# EAGLE design PIC18F25k50-USB+PicKit3-Board (EAGLE 7.2.0)
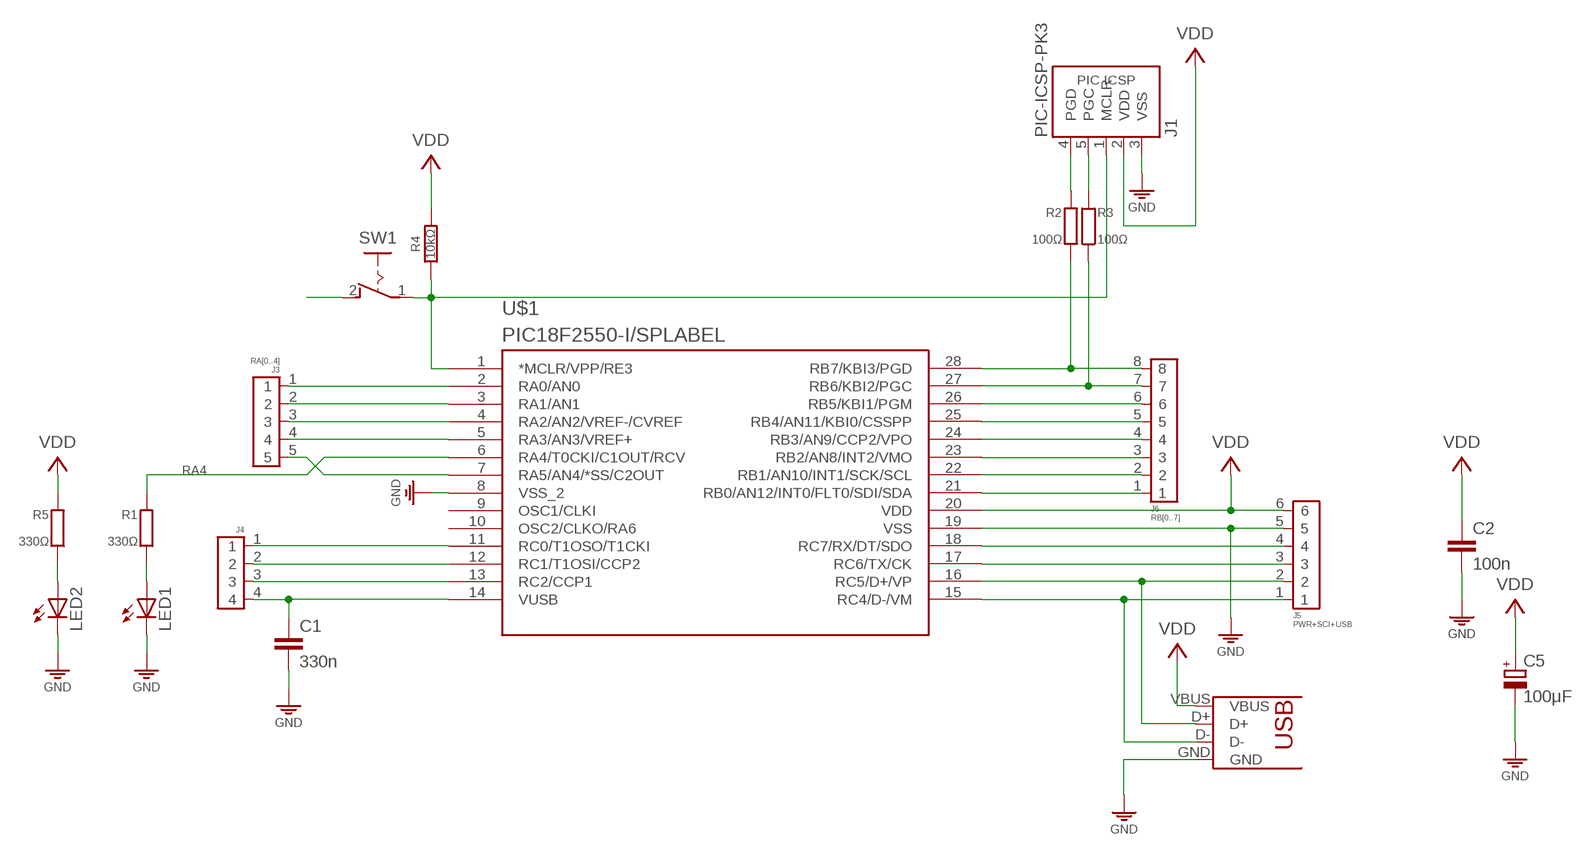
[diagram p0: schematic, sheet 1]

## Parts
C1  330n  C050-030X075  [C050-030X075]
C2  100n  C025-015X024  [C025-015X024]
C5  100μF  CPOLE2.5-5  [E2,5-5]
J1  PIC-ICSP-PK3  [PIC-PK3]
J2  USB-PRINT  [USB-B-PRINT]
J3  RA[0..4]  CONN-5P  [CONN-5P-N]
J4  RC[0..3]  CONN-4P-4P  [CONN-4P]
J5  PWR+SCI+USB  CONN-6P  [CONN-6P]
J6  RB[0..7]  CONN-8P  [CONN-8P]
LED1  LED5MM  [LED5MM]
LED2  LED5MM  [LED5MM]
R1  330Ω  R0204/10  [0204/10]
R2  100Ω  R0204/7-V  [0204/7-V]
R3  100Ω  R0204/7-V  [0204/7-V]
R4  10kΩ  R-H0204/10  [0204/10]
R5  330Ω  R0204/10  [0204/10]
SW1  PB-1P-1T  [PB-1P1T]
U$1  PIC18F2550-I/SPLABEL  [PIC18F2550-V]

## Nets
/MCLR: J1.1(MCLR) R4.1 SW1.1(P) U$1.1(*MCLR/VPP/RE3)
A0: J3.1 U$1.2(RA0/AN0)
A1: J3.2 U$1.3(RA1/AN1)
A2: J3.3 U$1.4(RA2/AN2/VREF-/CVREF)
A3: J3.4 U$1.5(RA3/AN3/VREF+)
B1: J6.2 U$1.22(RB1/AN10/INT1/SCK/SCL)
B2: J6.3 U$1.23(RB2/AN8/INT2/VMO)
B3: J6.4 U$1.24(RB3/AN9/CCP2/VPO)
B4: J6.5 U$1.25(RB4/AN11/KBI0/CSSPP)
B5: J6.6 U$1.26(RB5/KBI1/PGM)
D+: J2.D+ J5.2 U$1.16(RC5/D+/VP)
D-: J2.D- J5.1 U$1.15(RC4/D-/VM)
GND: C1.2 C2.2 C5.- J1.3(VSS) J2.GND J5.5 LED1.K(C) LED2.K(C) SW1.2(S) U$1.8(VSS_2) U$1.19(VSS)
N$1: LED1.A R1.2
N$2: LED2.A R5.2
N$13: J6.1 U$1.21(RB0/AN12/INT0/FLT0/SDI/SDA)
N$24: J1.4(PGD) R2.1
N$25: J1.5(PGC) R3.1
PGC: J6.7 R3.2 U$1.27(RB6/KBI2/PGC)
PGD: J6.8 R2.2 U$1.28(RB7/KBI3/PGD)
RA4: R1.1 U$1.6(RA4/T0CKI/C1OUT/RCV)
RA5: J3.5 U$1.7(RA5/AN4/*SS/C2OUT)
RC0: J4.1 U$1.11(RC0/T1OSO/T1CKI)
RC1: J4.2 U$1.12(RC1/T1OSI/CCP2)
RC2: J4.3 U$1.13(RC2/CCP1)
RX: J5.4 U$1.18(RC7/RX/DT/SDO)
TX: J5.3 U$1.17(RC6/TX/CK)
VCC: C2.1 C5.+ J1.2(VDD) J2.VBUS J5.6 R4.2 R5.1 U$1.20(VDD) ; supply symbol labelled VDD
VUSB: C1.1 J4.4 U$1.14(VUSB)
Unconnected: U$1.9(OSC1/CLKI) U$1.10(OSC2/CLKO/RA6)

## Library data of the parts
C1 C2 = c:C: CAPACITOR, European symbol
C5 = c:CPOL: POLARIZED CAPACITOR, European symbol
J1 = pinconn:PIC-ICSP
J2 = usb:USB: USB Connectors USB-B-PTH is fully proven SKU : PRT-00139 USB-miniB is fully proven SKU : PRT-00587 USB-A-PCB is untested. USB-A-H is throughly reviewed, but untested. Spark Fun Electronics SKU : PRT-00437 USB-B-SMT is throughly reviewed, but untested. Needs silkscreen touching up. USB-A-S has not been used/tested USB-MB-H has not been used/tested
J3 = pinconn:CONN-5P
J4 = pinconn:CONN-4P
J5 = pinconn:CONN-6P
J6 = pinconn:CONN-8P
LED1 LED2 = led:LED: LED OSRAM: - CHIPLED LG R971, LG N971, LY N971, LG Q971, LY Q971, LO R971, LY R971 LH N974, LH R974 LS Q976, LO Q976, LY Q976 LO Q996 - Hyper CHIPLED LW Q18S LB Q993, LB Q99A, LB R99A - SideLED LS A670, LO A670, LY A670, LG A670, LP A670 LB A673, LV A673, LT A673, LW A673 LH A674 LY A675 LS A676, LA A676, LO A676, LY A676, LW A676 LS A679, LY A679, LG A679 - Hyper Micro SIDELED® LS Y876, LA Y876, LO Y876, LY Y876 LT Y87S - SmartLED LW L88C, LW L88S LB L89C, LB L89S, LG L890 LS L89K, LO L89K, LY L89K LS L896, LA L896, LO L896, LY L896 - TOPLED LS T670, LO T670, LY T670, LG T670, LP T670 LSG T670, LSP T670, LSY T670, LOP T670, LYG T670 LG T671, LOG T671, LSG T671 LB T673, LV T673, LT T673, LW T673 LH T674 LS T676, LA T676, LO T676, LY T676, LB T676, LH T676, LSB T676, LW T676 LB T67C, LV T67C, LT T67C, LS T67K, LO T67K, LY T67K, LW E67C LS E67B, LA E67B, LO E67B, LY E67B, LB E67C, LV E67C, LT E67C LW T67C LS T679, LY T679, LG T679 LS T770, LO T770, LY T770, LG T770, LP T770 LB T773, LV T773, LT T773, LW T773 LH T774 LS E675, LA E675, LY E675, LS T675 LS T776, LA T776, LO T776, LY T776, LB T776 LHGB T686 LT T68C, LB T68C - Hyper Mini TOPLED® LB M676 - Mini TOPLED Santana® LG M470 LS M47K, LO M47K, LY M47K Source: http://www.osram.convergy.de LUXEON: - LUMILED® LXK2-PW12-R00, LXK2-PW12-S00, LXK2-PW14-U00, LXK2-PW14-V00 LXK2-PM12-R00, LXK2-PM12-S00, LXK2-PM14-U00 LXK2-PE12-Q00, LXK2-PE12-R00, LXK2-PE12-S00, LXK2-PE14-T00, LXK2-PE14-U00 LXK2-PB12-K00, LXK2-PB12-L00, LXK2-PB12-M00, LXK2-PB14-N00, LXK2-PB14-P00, LXK2-PB14-Q00 LXK2-PR12-L00, LXK2-PR12-M00, LXK2-PR14-Q00, LXK2-PR14-R00 LXK2-PD12-Q00, LXK2-PD12-R00, LXK2-PD12-S00 LXK2-PH12-R00, LXK2-PH12-S00 LXK2-PL12-P00, LXK2-PL12-Q00, LXK2-PL12-R00 Source: www.luxeon.com KINGBRIGHT: KA-3528ASYC Source: www.kingbright.com
R1-R3 R5 = r:R: RESISTOR, European symbol
R4 = r:R-H
SW1 = sw:PB-1P-1T
U$1 = mcu:PIC18F2550-I/SP

## Board
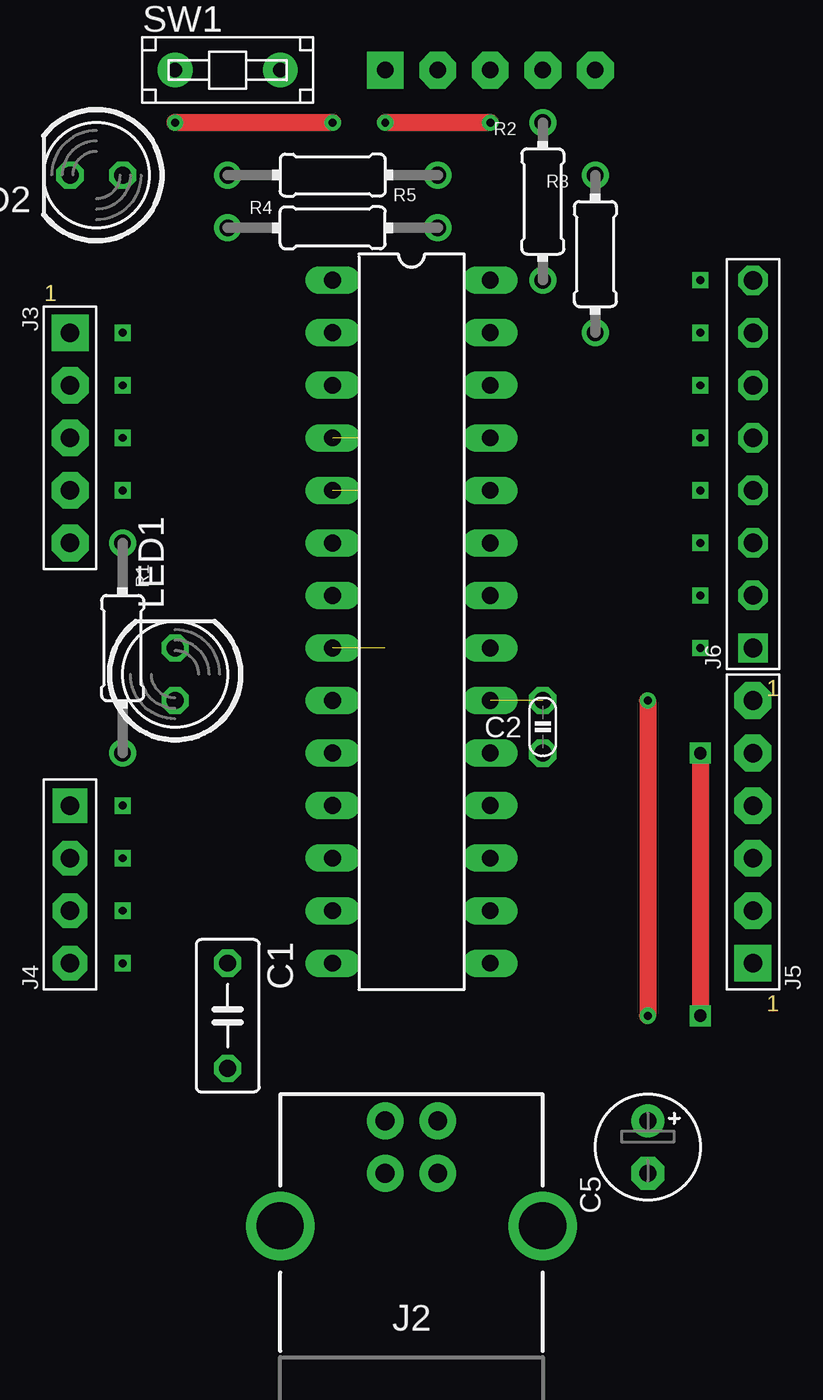
[diagram p1: board, top side]
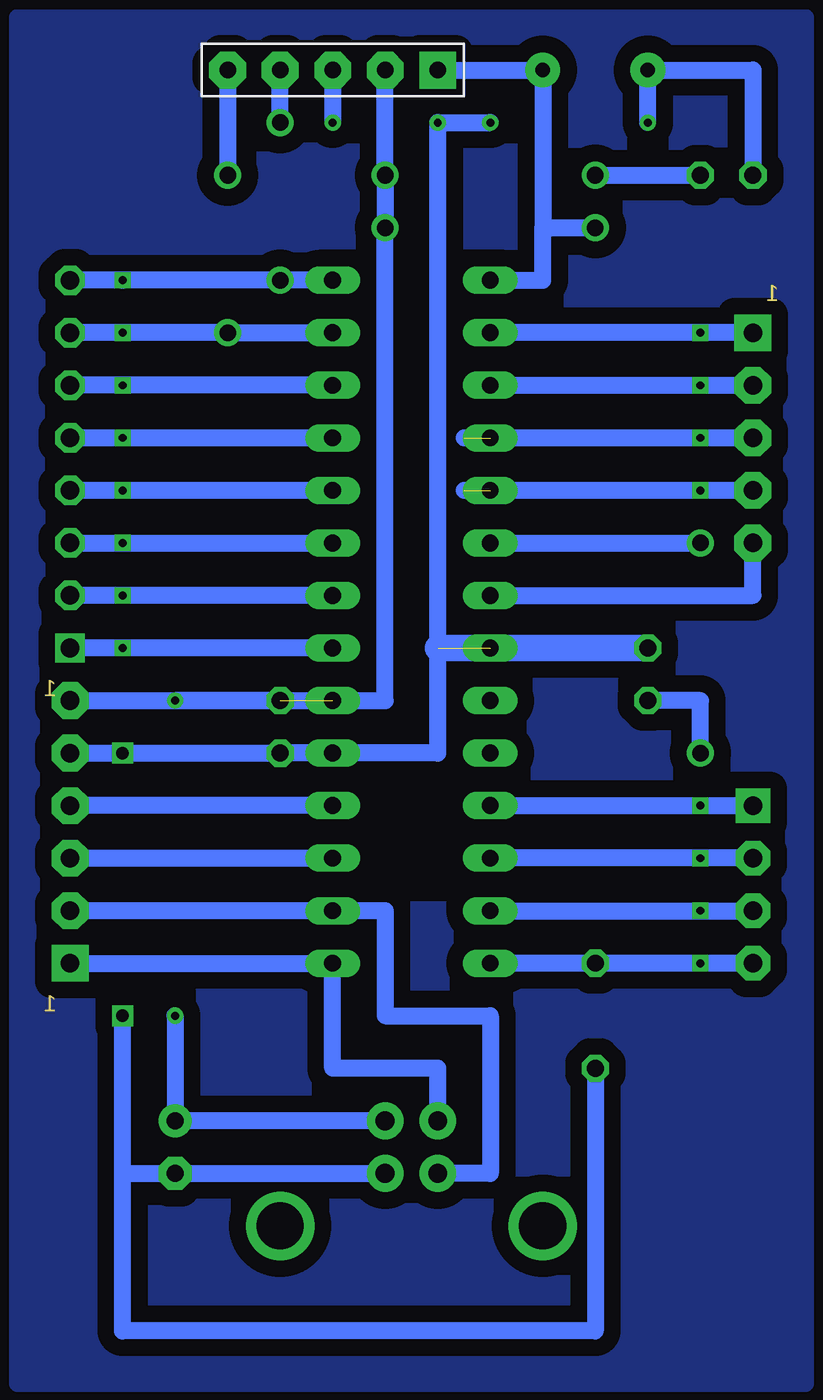
[diagram p2: board, bottom side, seen from below]

No outline drawn. Coordinates in mm, seen from the top.
Copper layers (1*16): Top 0.035mm / dielectric 1.5mm / Bottom 0.035mm
Design rules "default": minimum track width 10mil, minimum drill 24mil, track to track 8mil, track to pad 8mil, pad to pad 8mil, via to via 8mil, smd to smd 8mil, copper to edge 40mil, drill to drill 8mil, minimum pad ring 10mil, minimum via ring 8mil, stop-mask expansion 4mil, vias tented up to drill 0mil, thermal gap 10mil
bRestrict: area 17.8,24.1 to 20.3,29.2

### Footprints (pad centres in the part's own frame; a part is rotated, then mirrored left to right if it is on the bottom)
C050-030X075 = drill 0.813 octagon: 1 -2.54,0; 2 2.54,0
C025-015X024 = drill 0.813 octagon: 1 0,1.27; 2 0,-1.27
E2,5-5 = drill 0.813 pad 1.6: + 1.27,0 | drill 0.813 pad 1.6 octagon: - -1.27,0
PIC-PK3 = drill 0.8 pad 1.778 square: 1 -5.08,0 | drill 0.8 pad 1.778 octagon: 2 -2.54,0; 3 0,0; 4 2.54,0; 5 5.08,0
USB-B-PRINT = drill 0.914 pad 1.778: D+ 2.54,0; D- 5.08,0; GND 2.54,-2.54; VBUS 5.08,-2.54 | drill 2.286: P$1 0,-7.62; P$2 0,5.08
CONN-5P-N = drill 0.9 pad 1.778 square: 1 -5.08,0 | drill 0.9 pad 1.778 octagon: 2 -2.54,0; 3 0,0; 4 2.54,0; 5 5.08,0
CONN-4P = drill 0.9 pad 1.676 square: 1 -3.81,0 | drill 0.9 pad 1.676 octagon: 2 -1.27,0; 3 1.27,0; 4 3.81,0
CONN-6P = drill 0.9 pad 1.778 square: 1 -6.35,0 | drill 0.9 pad 1.778 octagon: 2 -3.81,0; 3 -1.27,0; 4 1.27,0; 5 3.81,0; 6 6.35,0
CONN-8P = drill 0.9 pad 1.422 square: 1 0,0 | drill 0.9 pad 1.422 octagon: 2 2.54,0; 3 5.08,0; 4 7.62,0; 5 10.16,0; 6 12.7,0; 7 15.24,0; 8 17.78,0
LED5MM = drill 0.813 octagon: A -1.27,0; K 1.27,0
0204/10 = drill 0.8: 1 -5.08,0; 2 5.08,0
0204/7-V = drill 0.8: 1 0,3.81; 2 0,-3.81
PB-1P1T = drill 0.7 pad 1.676: 1 2.54,0; 2 -2.54,0
PIC18F2550-V = drill 0.813 long: 1 -3.81,15.24; 2 -3.81,12.7; 3 -3.81,10.16; 4 -3.81,7.62; 5 -3.81,5.08; 6 -3.81,2.54; 7 -3.81,0; 8 -3.81,-2.54; 9 -3.81,-5.08; 10 -3.81,-7.62; 11 -3.81,-10.16; 12 -3.81,-12.7; 13 -3.81,-15.24; 14 -3.81,-17.78; 15 3.81,-17.78; 16 3.81,-15.24; 17 3.81,-12.7; 18 3.81,-10.16; 19 3.81,-7.62; 20 3.81,-5.08; 21 3.81,-2.54; 22 3.81,0; 23 3.81,2.54; 24 3.81,5.08; 25 3.81,7.62; 26 3.81,10.16; 27 3.81,12.7; 28 3.81,15.24

### Placement (x,y rotation side)
C1  10.16,17.78 270 top
C2  25.4,31.75 0 top
C5  30.48,11.43 90 top
J1  22.86,63.5 0 top
J2  17.78,7.62 90 top
J3  2.54,45.72 270 top
J4  2.54,24.13 270 top
J5  35.56,26.67 90 top
J6  35.56,35.56 90 top
LED1  7.62,34.29 90 top
LED2  3.81,58.42 180 top
R1  5.08,35.56 270 top
R2  25.4,57.15 0 top
R3  27.94,54.61 0 top
R4  15.24,55.88 0 top
R5  15.24,58.42 180 top
SW1  10.16,63.5 0 top
U$1  19.05,38.1 0 top

### Tracks (layer width: path | path; a pad name or v marks a point on that pad's centre or on a via)
/MCLR  (via drill 0.38)
  Bottom 0.813: U$1.1 12.7,53.34 12.7,55.88 | J1.1 SW1.1 12.7,55.88 | 12.7,55.88 R4.1
  other vias: 12.7,63.5 12.7,63.5
A0  (via drill 0.38)
  Bottom 0.813: J3.1 v5.08,50.8 U$1.2
A1  (via drill 0.38)
  Bottom 0.813: U$1.3 v5.08,48.26 J3.2
A2  (via drill 0.38)  (1 unrouted)
  Bottom 0.813: J3.3 v5.08,45.72 16.51,45.72
A3  (via drill 0.38)  (1 unrouted)
  Bottom 0.813: J3.4 v5.08,43.18 16.51,43.18
B1  (via drill 0.38)
  Bottom 0.813: U$1.22 v33.02,38.1 J6.2
B2  (via drill 0.38)
  Bottom 0.813: J6.3 v33.02,40.64 U$1.23
B3  (via drill 0.38)
  Bottom 0.813: U$1.24 v33.02,43.18 J6.4
B4  (via drill 0.38)
  Bottom 0.813: U$1.25 v33.02,45.72 J6.5
B5  (via drill 0.38)
  Bottom 0.813: U$1.26 v33.02,48.26 J6.6
D+
  Bottom 0.813: J2.D+ 15.24,10.16 15.24,17.78 20.32,17.78 20.32,22.86 U$1.16 J5.2
D-
  Bottom 0.813: J2.D- 17.78,15.24 22.86,15.24 U$1.15 J5.1
GND  (via drill 0.38, 0.6)  (1 unrouted)
  Top 0.813: v33.02,30.48 v33.02,17.78 | v22.86,60.96 v17.78,60.96 | v15.24,60.96 v7.62,60.96
  Bottom 0.813: J5.5 v33.02,30.48 C2.2 U$1.19 17.78,30.48 17.78,35.56 v17.78,60.96 v15.24,60.96 | 33.02,10.16 v33.02,17.78 | C1.2 10.16,2.54 33.02,2.54 33.02,10.16 | 33.02,10.16 C5.- J2.GND | J1.3 v22.86,60.96 | v7.62,60.96 SW1.2 2.54,63.5 LED2.K
  Bottom 1.27: LED1.K 17.78,35.56
N$1
  Bottom 0.813: R1.2 5.08,33.02 LED1.A
N$2
  Bottom 0.813: R5.2 LED2.A
N$3
  pour Bottom (isolate 0.813): 0,0 38.1,0 38.1,66.04 0,66.04
N$13  (via drill 0.38)
  Bottom 0.813: U$1.21 v33.02,35.56 J6.1
N$24
  Bottom 0.813: R2.1 J1.4
N$25
  Bottom 0.813: J1.5 R3.1
PGC  (via drill 0.38)
  Bottom 0.813: J6.7 v33.02,50.8 R3.2 U$1.27
PGD  (via drill 0.38)
  Bottom 0.813: J6.8 v33.02,53.34 R2.2 U$1.28
RA4  (via drill 0.38)
  Bottom 0.813: U$1.6 R1.1
  other vias: 5.08,40.64
RA5
  Bottom 0.813: U$1.7 2.54,38.1 J3.5
RC0  (via drill 0.38)
  Bottom 0.813: U$1.11 v5.08,27.94 J4.1
RC1  (via drill 0.38)
  Bottom 0.813: J4.2 v5.08,25.4 U$1.12
RC2  (via drill 0.38)
  Bottom 0.813: U$1.13 v5.08,22.86 J4.3
RX
  Bottom 0.813: U$1.18 J5.4
TX
  Bottom 0.813: J5.3 U$1.17
VCC  (via drill 0.38)  (1 unrouted)
  Top 0.813: v30.48,33.02 v30.48,17.78
  Bottom 0.813: J5.6 C2.1 v30.48,33.02 20.32,33.02 R4.2 R5.1 J1.2 | v30.48,17.78 C5.+ J2.VBUS
VUSB  (via drill 0.38)
  Bottom 0.813: J4.4 v5.08,20.32 C1.1 U$1.14

### Text on the board
Reference: 25 | 24 | 23 | 22 | 21 | 20 | 19 | 18 | 17 | 16 | 15 | 14 | 13 | 12 | 11 | 10 | 9 | 8 | 7 | 6 | 5 | 4 | 3 | 2 | 1 | 1 | 2 | 3 | 4 | 5 | 6 | 7 | 8 | 9 | 10 | 11 | 12 | 13 | 14